# EAGLE design Shield (EAGLE 9.3.2)
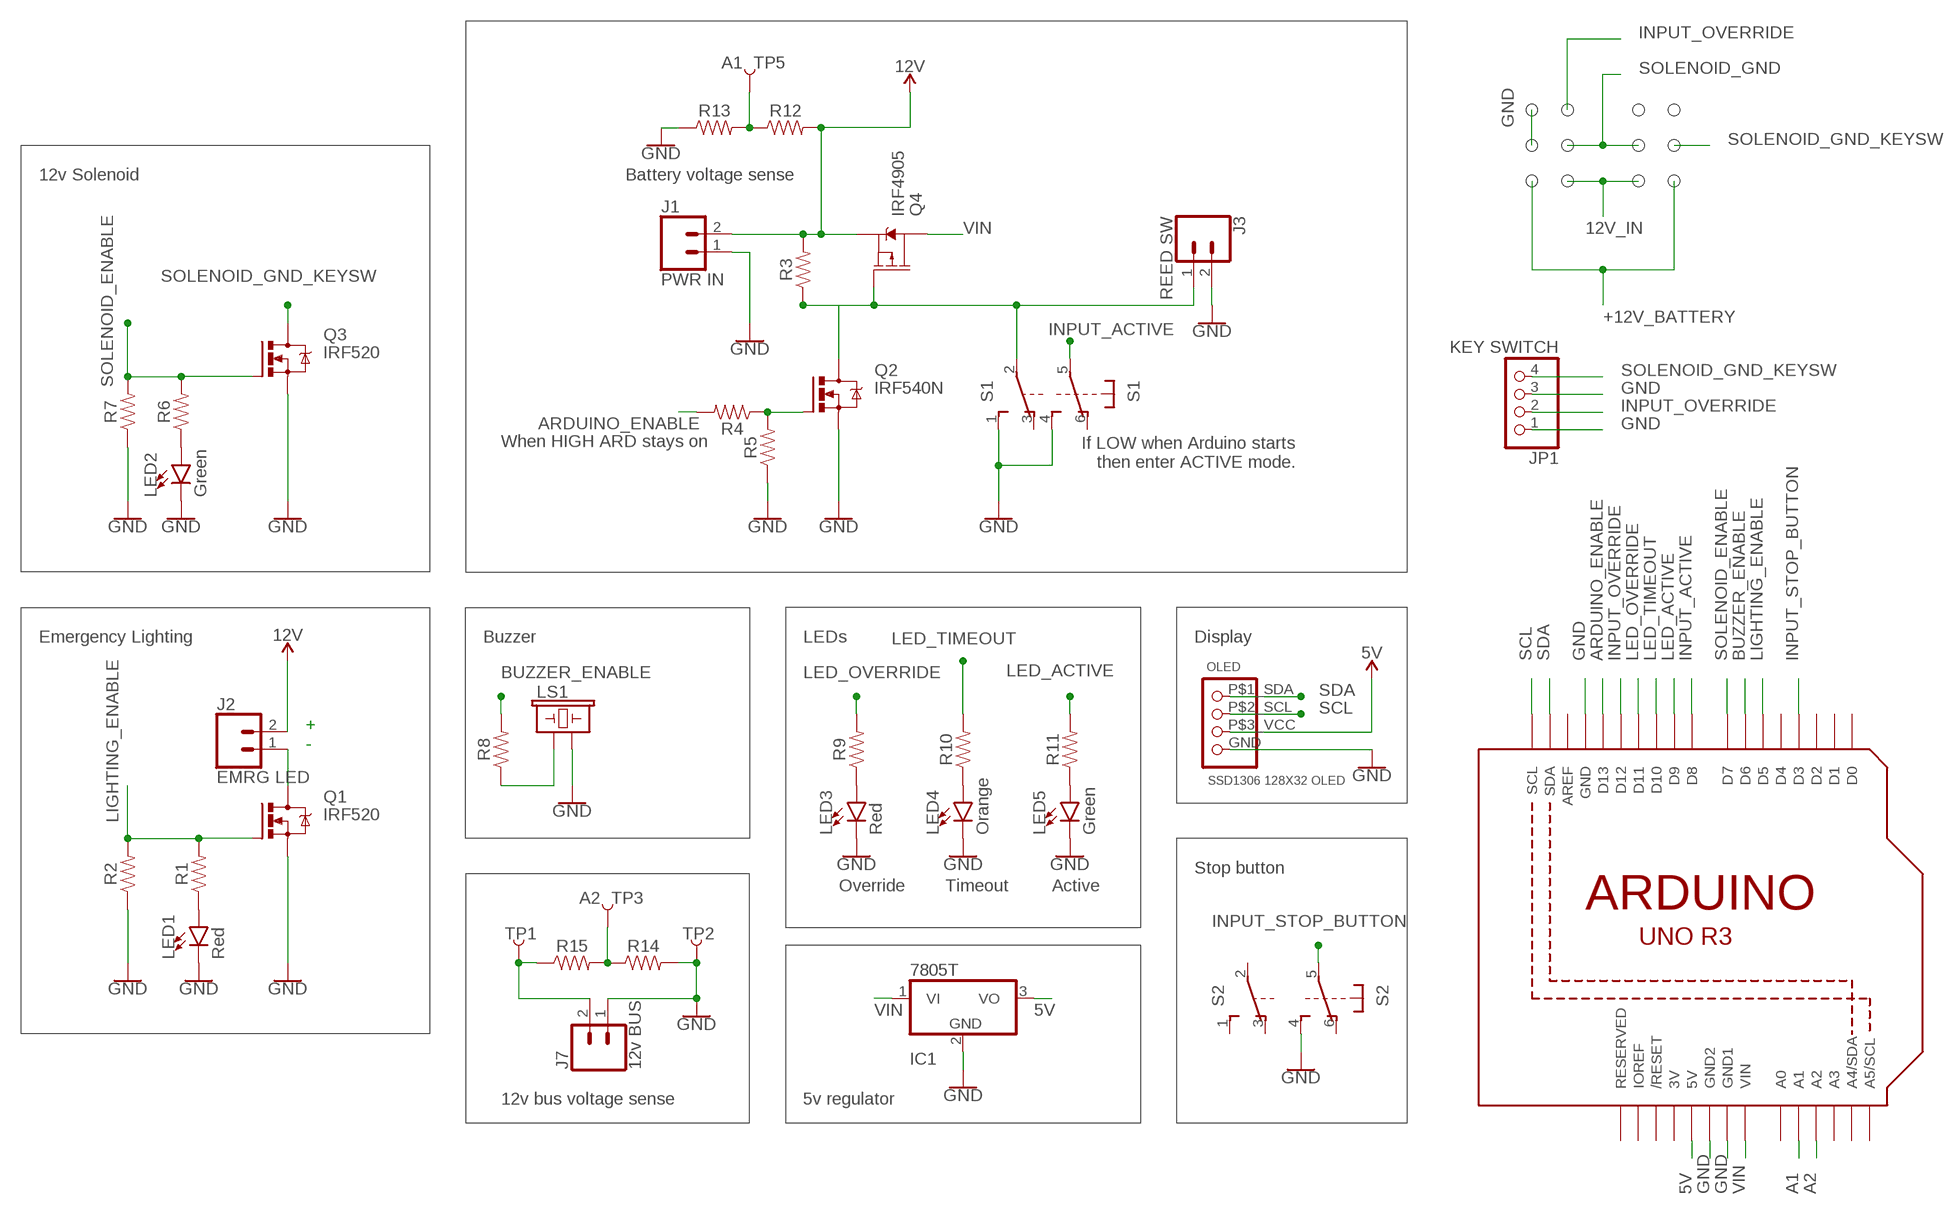
[diagram p0: schematic, sheet 1]

## Parts
IC1  7805T  [TO220H]
J1  PWR IN  CONN_025MM  [SCREWTERMINAL-5MM-2]
J2  EMRG LED  CONN_025MM  [SCREWTERMINAL-5MM-2]
J3  REED SW  CONN_025MM  [SCREWTERMINAL-5MM-2]
J7  12v BUS  CONN_025MM  [SCREWTERMINAL-5MM-2]
JP1  KEY SWITCH  PINHD-1X4  [1X04]
LED1  Red  LED3MM  [LED_3MM]
LED2  Green  LED3MM  [LED_3MM]
LED3  Red  LED3MM  [LED_3MM]
LED4  Orange  LED3MM  [LED_3MM]
LED5  Green  LED3MM  [LED_3MM]
LS1  BUZZER  BUZZER-PTH_KIT  [BUZZER-12MM-KIT]
OLED  SSD1306 128X32 OLED  SSD1306_128X32_OLED  [SSD1306_128X32_OLED]
Q1  IRF520  [TO220BV]
Q2  IRF540N  IRF540  [TO220BV]
Q3  IRF520  [TO220BV]
Q4  IRF4905  MOSFET_PCH-NDP6020P  [TO220V]
R1  1k  1KOHM-HORIZ-1/4W-5%  [AXIAL-0.3]
R2  1k  1KOHM-HORIZ-1/4W-5%  [AXIAL-0.3]
R3  100k  1KOHM-HORIZ-1/4W-5%  [AXIAL-0.3]
R4  100  1KOHM-HORIZ-1/4W-5%  [AXIAL-0.3]
R5  10k  1KOHM-HORIZ-1/4W-5%  [AXIAL-0.3]
R6  1k  1KOHM-HORIZ-1/4W-5%  [AXIAL-0.3]
R7  1k  1KOHM-HORIZ-1/4W-5%  [AXIAL-0.3]
R8  100  1KOHM-HORIZ-1/4W-5%  [AXIAL-0.3]
R9  330  1KOHM-HORIZ-1/4W-5%  [AXIAL-0.3]
R10  330  1KOHM-HORIZ-1/4W-5%  [AXIAL-0.3]
R11  330  1KOHM-HORIZ-1/4W-5%  [AXIAL-0.3]
R12  1m  1KOHM-HORIZ-1/4W-5%  [AXIAL-0.3]
R13  100k  1KOHM-HORIZ-1/4W-5%  [AXIAL-0.3]
R14  100k  1KOHM-HORIZ-1/4W-5%  [AXIAL-0.3]
R15  1m  1KOHM-HORIZ-1/4W-5%  [AXIAL-0.3]
S1  8X8_PCB_PUSH_BUTTON_DPDT  [8X8_PCB_PUSH_BUTTON_DPDT]
S2  8X8_PCB_PUSH_BUTTON_DPDT  [8X8_PCB_PUSH_BUTTON_DPDT]
TP1  TEST-POINT3X5  [PAD.03X.05]
TP2  TEST-POINT3X5  [PAD.03X.05]
TP3  TEST-POINT3X5  [PAD.03X.05]
TP5  TEST-POINT3X5  [PAD.03X.05]
U1  ARDUINOR3-DIMENSION  [ARDUINOR3]

## Nets
5V: IC1.3(VO) OLED.P$3_VCC(VCC) U1.5V
12V_IN: J1.2 J2.2 Q4.3(S) R3.P$2 R12.P$2 ; supply symbol labelled 12V
A1: R12.P$1 R13.P$2 TP5.P$1 U1.A1
A2: R14.P$1 R15.P$2 TP3.P$1 U1.A2
ARDUINO_ENABLE: R4.P$2 U1.D13
BUZZER_ENABLE: R8.P$2 U1.D6
GND: IC1.2(GND) J1.1 J3.2 J7.1 JP1.1 JP1.3 LED1.K(C) LED2.K(C) LED3.K(C) LED4.K(C) LED5.K(C) LS1.- OLED.GND Q1.S Q2.S Q3.S R2.P$1 R5.P$1 R7.P$1 R13.P$1 R14.P$2 S1.1(2:S) S1.4(1:S) S2.4(1:S) TP2.P$1 U1.GND U1.GND1 U1.GND2
INPUT_ACTIVE: S1.5(1:P) U1.D8
INPUT_OVERRIDE: JP1.2 U1.D12
INPUT_STOP_BUTTON: S2.5(1:P) U1.D3
LED_ACTIVE: R11.P$2 U1.D9
LED_OVERRIDE: R9.P$2 U1.D11
LED_TIMEOUT: R10.P$2 U1.D10
LIGHTING_ENABLE: Q1.G R1.P$2 R2.P$2 U1.D5
N$1: J2.1 Q1.D
N$2: LED1.A R1.P$1
N$3: J7.2 R15.P$1 TP1.P$1
N$4: J3.1 Q2.D Q4.1(G) R3.P$1 S1.2(2:P)
N$5: Q2.G R4.P$1 R5.P$2
N$7: LED2.A R6.P$1
N$8: LS1.+ R8.P$1
N$9: LED3.A R9.P$1
N$10: LED4.A R10.P$1
N$11: LED5.A R11.P$1
SCL: OLED.P$2_SCL(SCL) U1.SCL
SDA: OLED.P$1_SDA(SDA) U1.SDA
SOLENOID_ENABLE: Q3.G R6.P$2 R7.P$2 U1.D7
SOLENOID_GND_KEYSW: JP1.4 Q3.D
VIN: IC1.1(VI) Q4.2(D) U1.VIN
Unconnected: S1.3(2:O) S1.6(1:O) S2.1(2:S) S2.2(2:P) S2.3(2:O) S2.6(1:O) U1.A0 U1.A3 U1.A4(A4/SDA) U1.A5(A5/SCL) U1.AREF U1.D0 U1.D1 U1.D2 U1.D4 U1.IOREF U1.RESERVED U1.RESET(/RESET)

## Notes on the sheet
- 12v Solenoid | Battery voltage sense
- If LOW when Arduino starts
  then enter ACTIVE mode.
- When HIGH ARD stays on
- Emergency Lighting | Buzzer | LEDs | Display
- +
  -
- Stop button
- Override | Timeout | Active
- 12v bus voltage sense | 5v regulator

## Power pins joined to a net without a drawn wire
3V: U1.3V

## Library data of the parts
IC1 = adafruit:78*: Positive VOLTAGE REGULATOR Added bigger pads to the TO-92 package
J1-J3 J7 = SparkFun-Connectors:CONN_02: Multi connection point. Often used as Generic Header-pin footprint for 0.1 inch spaced/style header connections On any of the 0.1 inch spaced packages, you can populate with these: Break Away Headers - Straight <https://www.sparkfun.com/products/116> (PRT-00116) Break Away Male Headers - Right Angle <https://www.sparkfun.com/products/553> (PRT-00553) Female Headers <https://www.sparkfun.com/products/115> (PRT-00115) Break Away Headers - Machine Pin <https://www.sparkfun.com/products/117> (PRT-00117) Break Away Female Headers - Swiss Machine Pin <https://www.sparkfun.com/products/743> (PRT-00743) For SCREWTERMINALS and SPRING TERMINALS visit here: Screw Terimnals on SparkFun.com <https://www.sparkfun.com/search/results?term=Screw+Terminals> (5mm/3.5mm/2.54mm spacing) This device is also useful as a general connection point to wire up your design to another part of your project. Our various solder wires solder well into these plated through hole pads. Hook-Up Wire - Assortment (Stranded, 22 AWG) <https://www.sparkfun.com/products/11375> (PRT-11375) Hook-Up Wire - Assortment (Solid Core, 22 AWG) <https://www.sparkfun.com/products/11367> (PRT-11367) View the entire wire category on our website here <https://www.sparkfun.com/categories/141> Special notes: Molex polarized connector foot print use with: PRT-08233 with associated crimp pins and housings. 2.54_SCREWTERM for use with PRT-10571. 3.5mm Screw Terminal footprints for PRT-08084 5mm Screw Terminal footprints for use with PRT-08432; SF_SKU: PRT-08432
JP1 = pinhead:PINHD-1X4: PIN HEADER
LED1-LED5 = SparkFun-LED:LED: LED (Generic) Standard schematic elements and footprints for 5mm, 3mm, 1206, and 0603 sized LEDs. Generic LEDs with no color specified.; PROD_ID: DIO-08794
LS1 = SparkFun-Electromechanical:BUZZER: Buzzer Small round buzzers that operate around the audible 2kHz range. You can use these as speakers to create simple music or user interfaces. Variant Overview: PTH - Mini Speaker - PC Mount 12mm 2.048kHz <https://www.sparkfun.com/products/7950> PTH_KIT - Mini Speaker - PC Mount 12mm 2.048kHz <https://www.sparkfun.com/products/7950> KIT simplifies soldering by adding stop mask to one side of the pads. PTH_NO_SILK - Mini Speaker - PC Mount 12mm 2.048kHz <https://www.sparkfun.com/products/7950> No silkscreen indicator of buzzer outline. PTH_KIT_NO_SILK - Mini Speaker - PC Mount 12mm 2.048kHz <https://www.sparkfun.com/products/7950> KIT package w/o silkscreen SMD - Buzzer Audio Magnetic (CCV-084B16) SMD buzzer used on, e.g. the LilyPad Buzzer <https://www.sparkfun.com/products/8463> and RFID USB Reader <https://www.sparkfun.com/products/9963>. SMD_KIT - Buzzer Audio Magnetic (CCV-084B16) SMD Buzzer with elongated pins to make soldering easier. Used on the SparkFun Simon Says - Surface Mount Soldering Kit <https://www.sparkfun.com/products/10935>.; PROD_ID: COMP-08253; SF_SKU: COM-07950
OLED = m1dst:SSD1306_128X32_OLED
Q1 Q3 = transistor-power:IRF520: HEXFET Power MOSFET
Q2 = transistor-power:IRF540: HEXFET Power MOSFET
Q4 = SparkFun-DiscreteSemi:MOSFET_PCH: P-channel MOSFETs Voltage controlled devices that allow control of high current outputs. SparkFun Products: SparkFun ESP32 Thing <https://www.sparkfun.com/products/13907> SparkFun ESP8266 Thing <https://www.sparkfun.com/products/13231>; PROD_ID: TRANS-13060; VALUE: 24A/20V/50mΩ
R1 R2 R6 R7 = SparkFun-Resistors:1KOHM: 1kΩ resistor A resistor is a passive two-terminal electrical component that implements electrical resistance as a circuit element. Resistors act to reduce current flow, and, at the same time, act to lower voltage levels within circuits. - Wikipedia; PROD_ID: RES-08380
R3-R5 R8-R15 = SparkFun-Resistors:1KOHM: 1kΩ resistor A resistor is a passive two-terminal electrical component that implements electrical resistance as a circuit element. Resistors act to reduce current flow, and, at the same time, act to lower voltage levels within circuits. - Wikipedia; PROD_ID: RES-08380; VALUE: 1k
S1 S2 = m1dst:8X8_PCB_PUSH_BUTTON_DPDT: MARQUARDT SWITCH 9077.0200 Distributor: Buerklin <https://www.buerklin.com/default.asp?event=ShowArtikel%2812G2822%29&l=d&jump=ArtNr_12G2822>
TP1-TP3 TP5 = SparkFun-Connectors:TEST-POINT: SparkFun Test Points Bare copper test points for troubleshooting or In-Circuit-Testing. These are used by our Production team for verifying production board runs using pogo-pins on test beds. SparkFun Products: SparkFun LSM9DS1 Breakout <https://www.sparkfun.com/products/13284> SparkFun PSOC <https://www.sparkfun.com/products/13714> SparkFun Load Cell Amplifier <https://www.sparkfun.com/products/13879>
U1 = m1dst:ARDUINOR3: This is a new object for the new Arduino R3 - with extra pins that you may want to use (such as IOref, and duplicated A4/A5

## Board
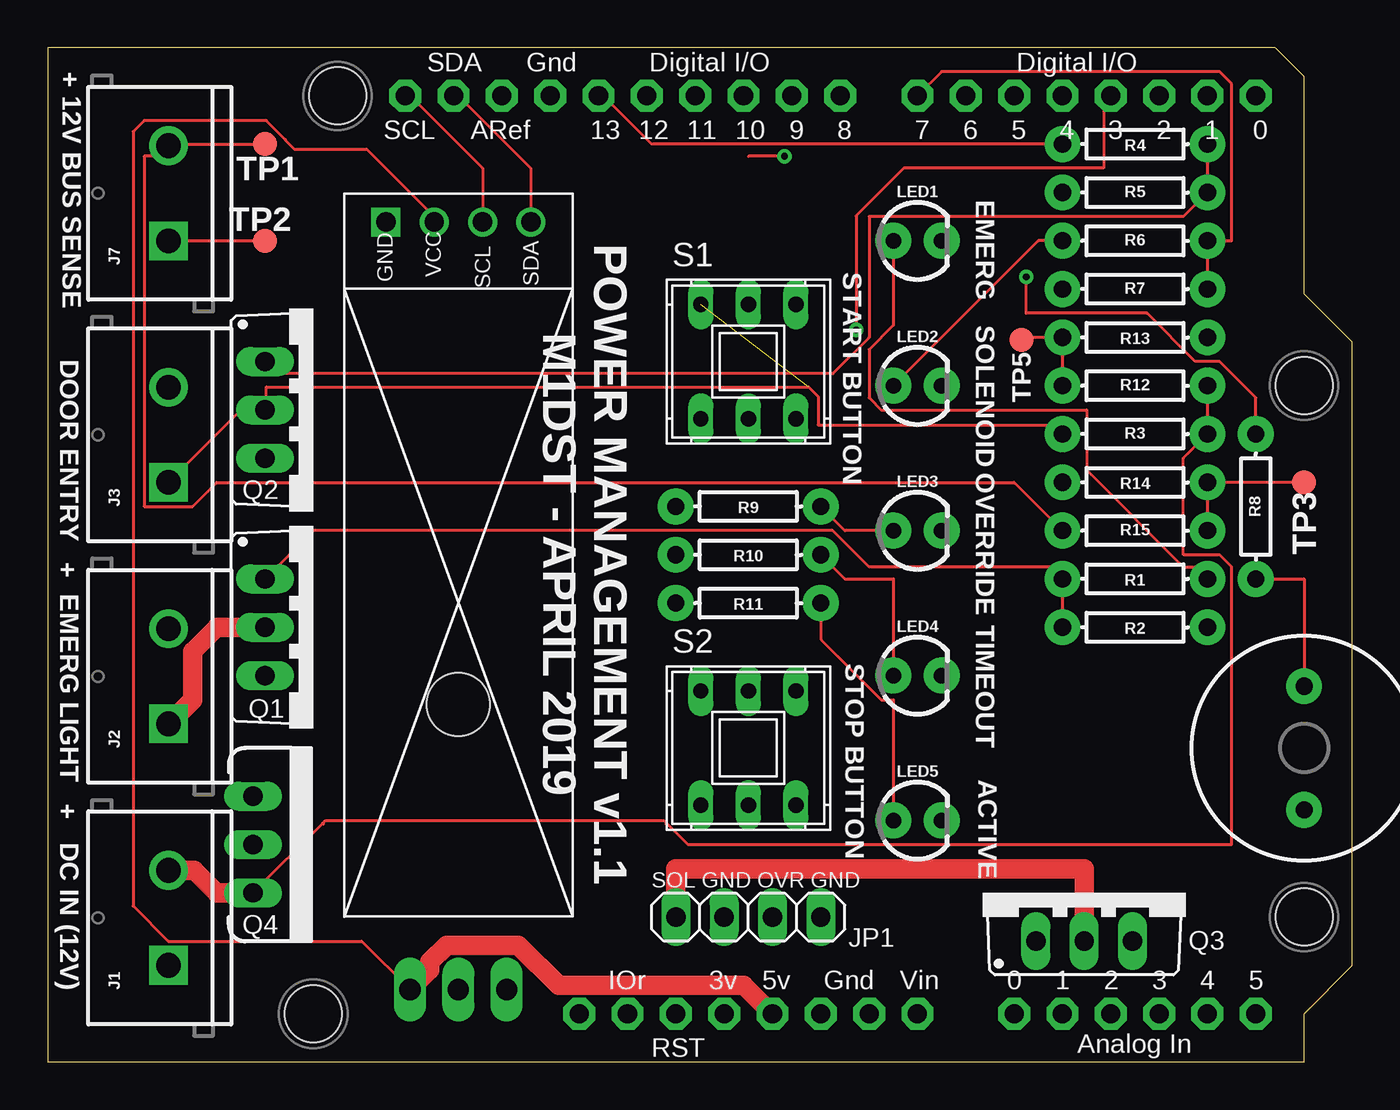
[diagram p1: board, top side]
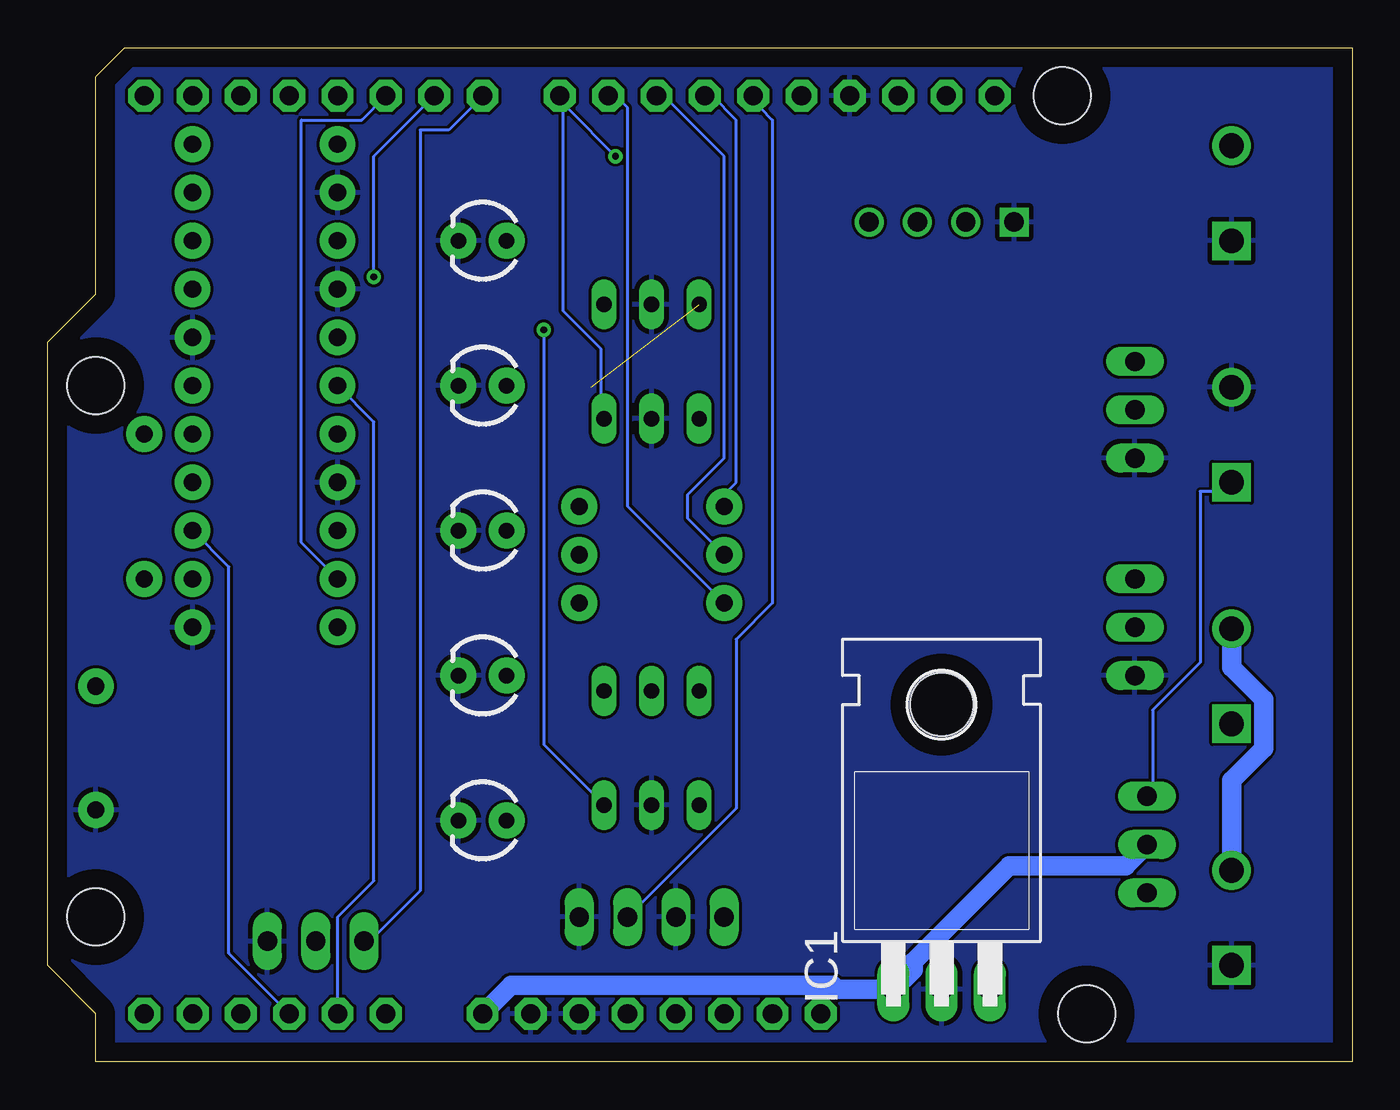
[diagram p2: board, bottom side, seen from below]

Size 68.58 x 53.34 mm. Coordinates in mm from the lower left corner, seen from the top.
Copper layers (1*16): Top 0.035mm / dielectric 1.5mm / Bottom 0.035mm
Design rules "default": minimum track width 6mil, minimum drill 0.35mm, track to track 6mil, track to pad 6mil, pad to pad 6mil, via to via 6mil, smd to smd 6mil, copper to edge 40mil, drill to drill 6mil, minimum pad ring 10mil, minimum via ring 8mil, stop-mask expansion 4mil, vias tented up to drill 0mil, thermal gap 10mil

### Footprints (pad centres in the part's own frame; a part is rotated, then mirrored left to right if it is on the bottom)
TO220H = drill 1.118 long: 1 -2.54,-10.16; 2 0,-10.16; 3 2.54,-10.16 | hole 3.302: 0,4.826
SCREWTERMINAL-5MM-2 = drill 1.3 pad 2.032 square: 1 0,0 | drill 1.3 pad 2.032: 2 5,0
1X04 = drill 1.016 long: 1 -3.81,0; 2 -1.27,0; 3 1.27,0; 4 3.81,0
LED_3MM = drill 0.813 pad 1.88: A -1.27,0; K 1.27,0
BUZZER-12MM-KIT = drill 0.9 pad 1.88: + 3.25,0; - -3.25,0
SSD1306_128X32_OLED = drill 1.016 square: GND -17.5,-3.81 | drill 1.016: P$1_SDA -17.5,3.81; P$2_SCL -17.5,1.27; P$3_VCC -17.5,-1.27
TO220BV = drill 1.016 long: D 0,-2.54; G -2.54,-2.54; S 2.54,-2.54
TO220V = drill 1.016 long: 1 -2.54,0; 2 0,0; 3 2.54,0
AXIAL-0.3 = drill 0.9 pad 1.88: P$1 -3.81,0; P$2 3.81,0
8X8_PCB_PUSH_BUTTON_DPDT = drill 0.813 long: 1 0,3; 2 -2.5,3; 3 2.5,3; 4 0,-3; 5 2.5,-3; 6 -2.5,-3
PAD.03X.05 = smd 1.27 x 1.27: P$1 0,0
ARDUINOR3 = drill 1 pad 1.676 octagon: 3V 35.56,2.54; 5V 38.1,2.54; A0 50.8,2.54; A1 53.34,2.54; A2 55.88,2.54; A3 58.42,2.54; A4 60.96,2.54; A5 63.5,2.54; AREF 23.876,50.8; D0 63.5,50.8; D1 60.96,50.8; D2 58.42,50.8; D3 55.88,50.8; D4 53.34,50.8; D5 50.8,50.8; D6 48.26,50.8; D7 45.72,50.8; D8 41.656,50.8; D9 39.116,50.8; D10 36.576,50.8; D11 34.036,50.8; D12 31.496,50.8; D13 28.956,50.8; GND 26.416,50.8; GND1 43.18,2.54; GND2 40.64,2.54; IOREF 30.48,2.54; RESERVED 27.94,2.54; RESET 33.02,2.54; SCL 18.796,50.8; SDA 21.336,50.8; VIN 45.72,2.54 | hole 3: 15.24,50.8; 13.97,2.54; 66.04,35.56; 66.04,7.62

### Placement (x,y rotation side)
IC1  21.59,13.97 0 bottom
J1  6.35,5.08 90 top
J2  6.35,17.78 90 top
J3  6.35,30.48 90 top
J7  6.35,43.18 90 top
JP1  36.83,7.62 180 top
LED1  45.72,43.18 0 top
LED2  45.72,35.56 0 top
LED3  45.72,27.94 0 top
LED4  45.72,20.32 0 top
LED5  45.72,12.7 0 top
LS1  66.04,16.51 90 top
OLED  21.59,26.67 270 top
Q1  13.97,22.86 270 top
Q2  13.97,34.29 270 top
Q3  54.48,8.89 0 top
Q4  10.79,11.43 270 top
R1  57.15,25.4 180 top
R2  57.15,22.86 180 top
R3  57.15,33.02 0 top
R4  57.15,48.26 180 top
R5  57.15,45.72 0 top
R6  57.15,43.18 0 top
R7  57.15,40.64 0 top
R8  63.5,29.21 90 top
R9  36.83,29.21 180 top
R10  36.83,26.67 180 top
R11  36.83,24.13 180 top
R12  57.15,35.56 0 top
R13  57.15,38.1 180 top
R14  57.15,30.48 180 top
R15  57.15,27.94 0 top
S1  36.83,36.83 0 top
S2  36.83,16.51 0 top
TP1  11.43,48.26 0 top
TP2  11.43,43.18 0 top
TP3  66.04,30.48 0 top
TP5  51.18,37.97 0 top
U1  0,0 0 top

### Tracks (layer width: path | path; a pad name or v marks a point on that pad's centre or on a via)
5V
  Top 0.152: OLED.P$3_VCC 20.32,44.45 16.77,48 12.96,48 12.5,48.46 12.5,48.5 11.5,49.5 5.08,49.5 4.5,48.92 4.5,8.2 6.35,6.35 16.51,6.35 IC1.3
  Top 1.016: IC1.3 20.09,4.85 20.09,5.27 20.97,6.15 24.75,6.15 26.86,4.04 36.6,4.04 U1.5V
12V_IN
  Top 0.152: R12.P$2 R3.P$2 59.69,31.75 59.69,26.67 61.59,26.67 62.23,26.04 62.23,11.43 33.66,11.43 32.54,12.54 | 32.54,12.54 32.38,12.7 14.61,12.7 14.45,12.55 | Q4.3 14.45,12.55 | 32.5,12.5 32.54,12.54 | 14.5,12.5 14.45,12.55
  Top 1.016: J1.2 7.7,10.08 8.89,8.89 Q4.3
  Bottom 1.016: J1.2 6.35,14.81 4.67,16.49 4.67,19.07 6.35,20.75 J2.2
A1
  Top 0.152: R12.P$1 R13.P$2 51.44,38.1 TP5.P$1
  Bottom 0.152: R12.P$1 51.44,33.66 51.44,9.53 53.34,7.62 U1.A1
A2
  Top 0.152: R15.P$2 R14.P$1 TP3.P$1
  Bottom 0.152: R15.P$2 59.05,26.04 59.05,5.71 U1.A2
ARDUINO_ENABLE
  Top 0.152: R4.P$2 31.75,48.26 29.21,50.8 U1.D13
BUZZER_ENABLE  (via drill 0.35)
  Top 0.152: v51.44,41.27 51.44,39.37 57.78,39.37 60.33,36.83 61.59,36.83 63.5,34.92 R8.P$2
  Bottom 0.152: U1.D6 51.44,47.62 v51.44,41.27
GND
  Top 0.152: J7.1 TP2.P$1
  pour Bottom: -2.54,54.61 73.66,54.61 73.66,-3.81 -2.54,-3.81
INPUT_ACTIVE  (via drill 0.35)
  Top 0.152: v38.73,47.62 36.83,47.62
  Bottom 0.152: v38.73,47.62 41.27,50.16 41.27,50.8 U1.D8 41.5,50.5 41.5,39.5 39.5,37.5 39.5,34 S1.5
INPUT_OVERRIDE
  Bottom 0.152: JP1.2 32.38,13.34 32.38,22.23 30.48,24.13 30.48,49.53 31.11,50.16 31.11,50.8 U1.D12
INPUT_STOP_BUTTON  (via drill 0.35)
  Top 0.152: v42.5,38.5 42.5,44.5 45,47 55.5,47 55.5,50.5 U1.D3
  Bottom 0.152: v42.5,38.5 42.5,16.69 39.34,13.53 S2.5
LED_ACTIVE
  Bottom 0.152: R11.P$2 38.1,29.21 38.1,50.16 38.73,50.8 U1.D9
LED_OVERRIDE
  Bottom 0.152: R9.P$2 33.02,29.84 32.38,30.48 32.38,49.53 33.66,50.8 U1.D11
LED_TIMEOUT
  Bottom 0.152: R10.P$2 34.92,28.57 34.92,29.84 33.02,31.75 33.02,47.62 36.2,50.8 U1.D10
LIGHTING_ENABLE
  Top 0.152: R2.P$2 R1.P$2 52.7,26.04 43.18,26.04 41.27,27.94 13.97,27.94 Q1.G
  Bottom 0.152: U1.D5 52.07,49.53 55.24,49.53 55.24,27.3 R1.P$2
N$1
  Top 1.016: J2.1 7.62,19.05 7.62,21.59 8.89,22.86 Q1.D
N$2
  Top 0.152: R1.P$1 60.33,26.04 59.69,26.04 54.61,31.11 54.61,34.29 43.81,34.29 43.18,34.92 43.18,37.47 44.45,38.73 LED1.A
N$3
  Top 0.152: TP1.P$1 6.35,48.26 J7.2 6.35,47.62 5.08,47.62 5.08,29.21 7.62,29.21 8.89,30.48 50.8,30.48 R15.P$1
N$4  (1 unrouted)
  Top 0.152: R3.P$1 53,33.5 40.5,33.5 40.5,35 40,35.5 11.5,35.5 11.5,34.5 Q2.D 10.16,34.29 J3.1
  Bottom 0.152: Q4.1 10.5,14 10.5,18.5 8,21 8,30 6.5,30 J3.1
N$5
  Top 0.152: R4.P$1 R5.P$2 59.69,44.45 43.18,44.45 43.18,38.1 41.27,36.2 12.06,36.2 Q2.G
N$7
  Top 0.152: LED2.A 52.07,43.18 R6.P$1
N$8
  Top 0.152: LS1.+ 66.04,25.4 R8.P$1
N$9
  Top 0.152: R9.P$1 41.91,27.94 LED3.A
N$10
  Top 0.152: LED4.A 44.45,25.4 41.91,25.4 R10.P$1
N$11
  Top 0.152: LED5.A 44.45,19.05 43.81,19.05 40.64,22.23 R11.P$1
SCL
  Top 0.152: OLED.P$2_SCL 22.86,46.99 19.05,50.8 U1.SCL
SDA
  Top 0.152: OLED.P$1_SDA 25.4,46.99 21.59,50.8 U1.SDA
SOLENOID_ENABLE
  Top 0.152: R7.P$2 R6.P$2 62.23,43.18 62.23,51.44 61.59,52.07 46.99,52.07 U1.D7
  Bottom 0.152: Q3.G 51.5,6.5 49,9 49,49 47.5,49 46,50.5 U1.D7
SOLENOID_GND_KEYSW
  Top 0.508: 53.98,6.35 Q3.D
  Top 1.016: JP1.4 33.02,10.16 54.48,10.16 Q3.D
  Bottom 0.152: 33,8 JP1.4
VIN
  Bottom 1.016: Q4.2 11.91,10.31 18.05,10.31 23.09,5.27 23.09,4.85 IC1.1 27.09,3.81 27.32,4.04 44.22,4.04 U1.VIN

### Text on the board
tPlace: + | 12V BUS SENSE | EMERG | START BUTTON | SOLENOID | DOOR ENTRY | OVERRIDE | POWER MANAGEMENT v1.1 / M1DST - APRIL 2019 | + | EMERG LIGHT | TIMEOUT | STOP BUTTON | ACTIVE | + | DC IN (12V) | SOL GND OVR GND